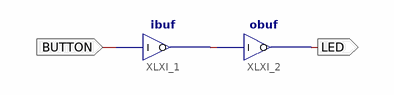
[diagram p0: schematic sheet 1]
// Xilinx ISE schematic CPLDIntro2Ledbutton.sch (xc9500xl) as structural Verilog: 2 symbols, 2 ports
module CPLDIntro2Ledbutton (
  input  BUTTON,
  output LED
);

  wire XLXN_10;

  ibuf XLXI_1 (.I(BUTTON), .O(XLXN_10));
  obuf XLXI_2 (.I(XLXN_10), .O(LED));
endmodule
